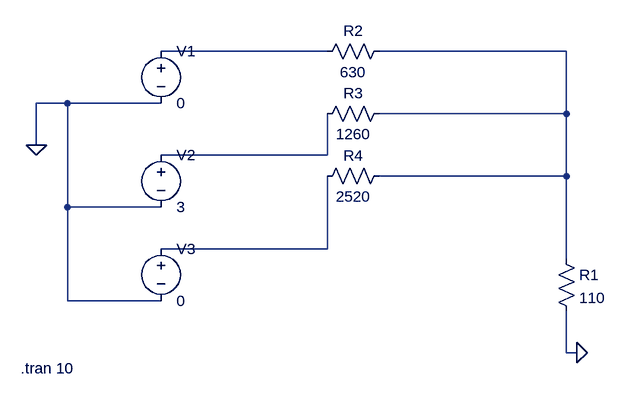
[diagram p0: schematic Draft2.asc]
Draft2.asc, the LTspice schematic file:
Version 4
SHEET 1 880 680
WIRE -160 -128 -416 -128
WIRE 208 -128 -80 -128
WIRE -560 -48 -608 -48
WIRE -416 -48 -560 -48
WIRE 208 -32 208 -128
WIRE 208 -32 -80 -32
WIRE -608 16 -608 -48
WIRE -160 32 -160 -32
WIRE -160 32 -416 32
WIRE 208 64 208 -32
WIRE 208 64 -80 64
WIRE -560 112 -560 -48
WIRE -416 112 -560 112
WIRE -160 176 -160 64
WIRE -160 176 -416 176
WIRE 208 192 208 64
WIRE -560 256 -560 112
WIRE -416 256 -560 256
WIRE 208 336 208 272
WIRE 224 336 208 336
FLAG 224 336 0
FLAG -608 16 0
SYMBOL res 192 176 R0
SYMATTR InstName R1
SYMATTR Value 110
SYMBOL res -64 -144 R90
WINDOW 0 0 56 VBottom 2
WINDOW 3 32 56 VTop 2
SYMATTR InstName R2
SYMATTR Value 630
SYMBOL res -64 -48 R90
WINDOW 0 0 56 VBottom 2
WINDOW 3 32 56 VTop 2
SYMATTR InstName R3
SYMATTR Value 1260
SYMBOL res -64 48 R90
WINDOW 0 0 56 VBottom 2
WINDOW 3 32 56 VTop 2
SYMATTR InstName R4
SYMATTR Value 2520
SYMBOL voltage -416 -144 R0
WINDOW 123 0 0 Left 2
WINDOW 39 0 0 Left 2
SYMATTR InstName V1
SYMATTR Value 0
SYMBOL voltage -416 16 R0
WINDOW 123 0 0 Left 2
WINDOW 39 0 0 Left 2
SYMATTR InstName V2
SYMATTR Value 3
SYMBOL voltage -416 160 R0
WINDOW 123 0 0 Left 2
WINDOW 39 0 0 Left 2
SYMATTR InstName V3
SYMATTR Value 0
TEXT -632 360 Left 2 !.tran 10

The netlist it stands for:
* Draft2.asc
R1 N002 0 110
R2 N002 N001 630
R3 N002 N003 1260
R4 N002 N004 2520
V1 N001 0 0
V2 N003 0 3
V3 N004 0 0
.tran 10
.backanno
.end